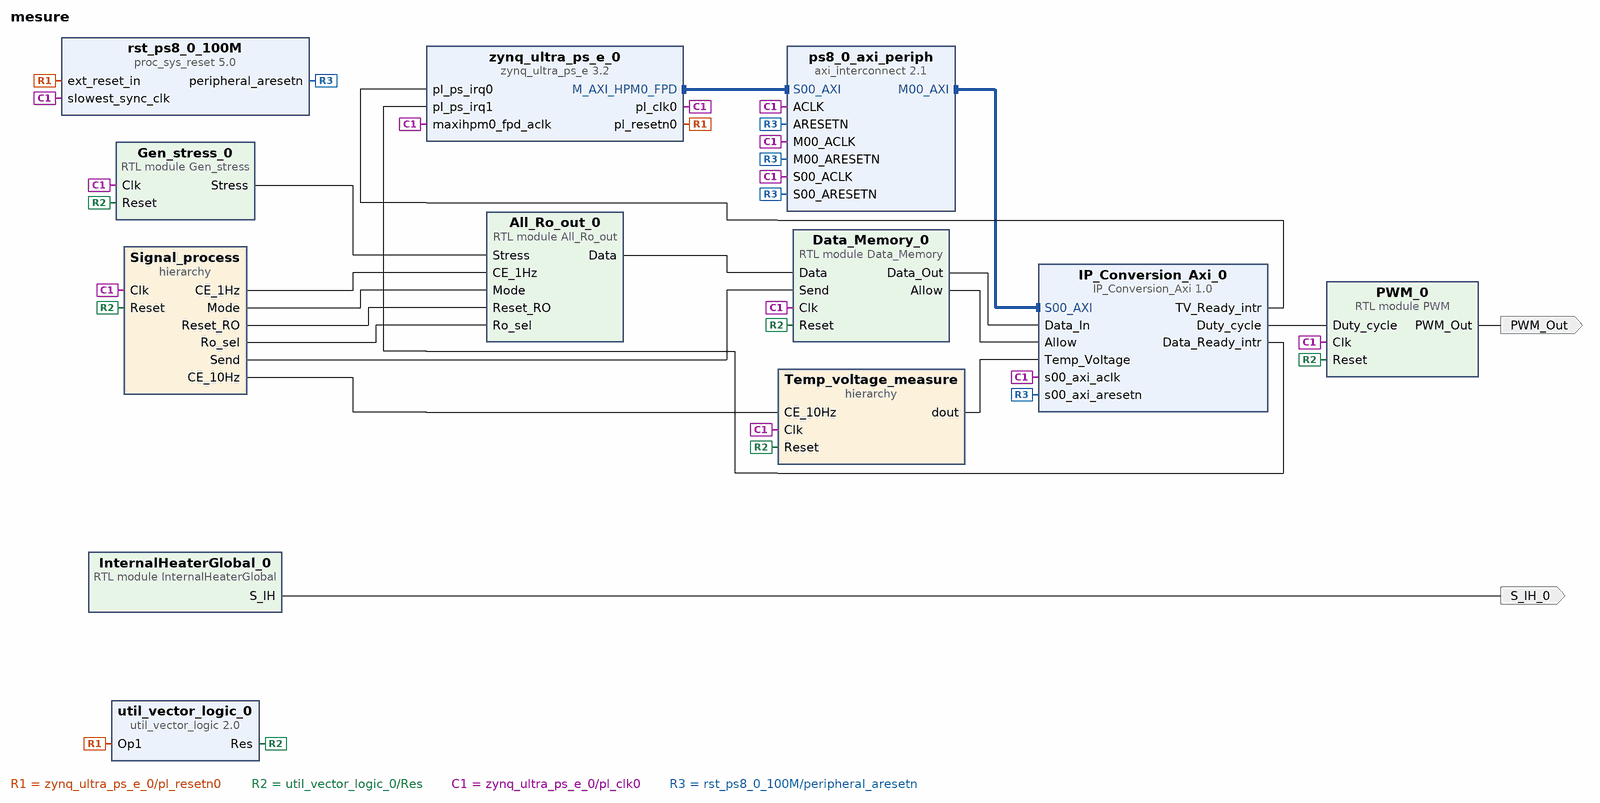
[diagram p0: block diagram of the top level]
# Vivado block design mesure, xczu3eg-sbva484-1-i, Vivado 2018.3
create_bd_design mesure

create_bd_port -dir O PWM_Out
create_bd_port -dir O S_IH_0

create_bd_cell -type ip -vlnv xilinx.com:ip:zynq_ultra_ps_e:3.2 zynq_ultra_ps_e_0
set_property -dict [list \
  CONFIG.PSU_BANK_0_IO_STANDARD LVCMOS18 \
  CONFIG.PSU_BANK_1_IO_STANDARD LVCMOS18 \
  CONFIG.PSU_BANK_2_IO_STANDARD LVCMOS18 \
  CONFIG.PSU_BANK_3_IO_STANDARD LVCMOS18 \
  CONFIG.PSU__CAN1__PERIPHERAL__ENABLE 0 \
  CONFIG.PSU__CRF_APB__ACPU_CTRL__SRCSEL APLL \
  CONFIG.PSU__CRF_APB__APLL_CTRL__SRCSEL PSS_REF_CLK \
  CONFIG.PSU__CRF_APB__DBG_FPD_CTRL__SRCSEL IOPLL \
  CONFIG.PSU__CRF_APB__DBG_TRACE_CTRL__SRCSEL IOPLL \
  CONFIG.PSU__CRF_APB__DBG_TSTMP_CTRL__SRCSEL IOPLL \
  CONFIG.PSU__CRF_APB__DDR_CTRL__FREQMHZ 533 \
  CONFIG.PSU__CRF_APB__DDR_CTRL__SRCSEL DPLL \
  CONFIG.PSU__CRF_APB__DPDMA_REF_CTRL__SRCSEL APLL \
  CONFIG.PSU__CRF_APB__DPLL_CTRL__SRCSEL PSS_REF_CLK \
  CONFIG.PSU__CRF_APB__DP_AUDIO_REF_CTRL__SRCSEL RPLL \
  CONFIG.PSU__CRF_APB__DP_STC_REF_CTRL__SRCSEL RPLL \
  CONFIG.PSU__CRF_APB__DP_VIDEO_REF_CTRL__SRCSEL VPLL \
  CONFIG.PSU__CRF_APB__GDMA_REF_CTRL__SRCSEL APLL \
  CONFIG.PSU__CRF_APB__GPU_REF_CTRL__SRCSEL IOPLL \
  CONFIG.PSU__CRF_APB__TOPSW_LSBUS_CTRL__SRCSEL IOPLL \
  CONFIG.PSU__CRF_APB__TOPSW_MAIN_CTRL__SRCSEL DPLL \
  CONFIG.PSU__CRF_APB__VPLL_CTRL__SRCSEL PSS_REF_CLK \
  CONFIG.PSU__CRF_APB__VPLL_FRAC_CFG__ENABLED 1 \
  CONFIG.PSU__CRL_APB__ADMA_REF_CTRL__SRCSEL IOPLL \
  CONFIG.PSU__CRL_APB__CAN1_REF_CTRL__SRCSEL IOPLL \
  CONFIG.PSU__CRL_APB__CPU_R5_CTRL__SRCSEL IOPLL \
  CONFIG.PSU__CRL_APB__CSU_PLL_CTRL__FREQMHZ 400 \
  CONFIG.PSU__CRL_APB__CSU_PLL_CTRL__SRCSEL IOPLL \
  CONFIG.PSU__CRL_APB__DBG_LPD_CTRL__SRCSEL IOPLL \
  CONFIG.PSU__CRL_APB__GEM3_REF_CTRL__SRCSEL IOPLL \
  CONFIG.PSU__CRL_APB__I2C0_REF_CTRL__SRCSEL IOPLL \
  CONFIG.PSU__CRL_APB__I2C1_REF_CTRL__SRCSEL IOPLL \
  CONFIG.PSU__CRL_APB__IOPLL_CTRL__DIV2 0 \
  CONFIG.PSU__CRL_APB__IOPLL_CTRL__SRCSEL PSS_REF_CLK \
  CONFIG.PSU__CRL_APB__IOU_SWITCH_CTRL__SRCSEL IOPLL \
  CONFIG.PSU__CRL_APB__LPD_LSBUS_CTRL__SRCSEL IOPLL \
  CONFIG.PSU__CRL_APB__LPD_SWITCH_CTRL__SRCSEL IOPLL \
  CONFIG.PSU__CRL_APB__PCAP_CTRL__SRCSEL IOPLL \
  CONFIG.PSU__CRL_APB__PL0_REF_CTRL__SRCSEL IOPLL \
  CONFIG.PSU__CRL_APB__QSPI_REF_CTRL__SRCSEL IOPLL \
  CONFIG.PSU__CRL_APB__RPLL_CTRL__SRCSEL PSS_REF_CLK \
  CONFIG.PSU__CRL_APB__RPLL_FRAC_CFG__ENABLED 1 \
  CONFIG.PSU__CRL_APB__SDIO0_REF_CTRL__SRCSEL IOPLL \
  CONFIG.PSU__CRL_APB__SDIO1_REF_CTRL__SRCSEL IOPLL \
  CONFIG.PSU__CRL_APB__SPI0_REF_CTRL__SRCSEL IOPLL \
  CONFIG.PSU__CRL_APB__SPI1_REF_CTRL__SRCSEL IOPLL \
  CONFIG.PSU__CRL_APB__TIMESTAMP_REF_CTRL__SRCSEL IOPLL \
  CONFIG.PSU__CRL_APB__UART0_REF_CTRL__SRCSEL IOPLL \
  CONFIG.PSU__CRL_APB__UART1_REF_CTRL__SRCSEL IOPLL \
  CONFIG.PSU__CRL_APB__USB0_BUS_REF_CTRL__FREQMHZ 250 \
  CONFIG.PSU__CRL_APB__USB0_BUS_REF_CTRL__SRCSEL IOPLL \
  CONFIG.PSU__CRL_APB__USB3_DUAL_REF_CTRL__FREQMHZ 20 \
  CONFIG.PSU__CRL_APB__USB3_DUAL_REF_CTRL__SRCSEL IOPLL \
  CONFIG.PSU__CRL_APB__USB3__ENABLE 1 \
  CONFIG.PSU__CSUPMU__PERIPHERAL__VALID 1 \
  CONFIG.PSU__DDRC__BUS_WIDTH {32 Bit} \
  CONFIG.PSU__DDRC__DEVICE_CAPACITY {16384 MBits} \
  CONFIG.PSU__DDRC__DRAM_WIDTH {32 Bits} \
  CONFIG.PSU__DDRC__ECC Disabled \
  CONFIG.PSU__DDRC__MEMORY_TYPE {LPDDR 4} \
  CONFIG.PSU__DDRC__SPEED_BIN LPDDR4_1066 \
  CONFIG.PSU__DDR_HIGH_ADDRESS_GUI_ENABLE 0 \
  CONFIG.PSU__DDR__INTERFACE__FREQMHZ 266.500 \
  CONFIG.PSU__DISPLAYPORT__LANE0__ENABLE 1 \
  CONFIG.PSU__DISPLAYPORT__LANE0__IO {GT Lane1} \
  CONFIG.PSU__DISPLAYPORT__LANE1__ENABLE 1 \
  CONFIG.PSU__DISPLAYPORT__LANE1__IO {GT Lane0} \
  CONFIG.PSU__DISPLAYPORT__PERIPHERAL__ENABLE 1 \
  CONFIG.PSU__DLL__ISUSED 1 \
  CONFIG.PSU__DPAUX__PERIPHERAL__ENABLE 1 \
  CONFIG.PSU__DPAUX__PERIPHERAL__IO {MIO 27 .. 30} \
  CONFIG.PSU__DP__LANE_SEL {Dual Lower} \
  CONFIG.PSU__DP__REF_CLK_FREQ 27 \
  CONFIG.PSU__DP__REF_CLK_SEL {Ref Clk1} \
  CONFIG.PSU__ENET3__PERIPHERAL__ENABLE 0 \
  CONFIG.PSU__FPGA_PL0_ENABLE 1 \
  CONFIG.PSU__GPIO0_MIO__IO {MIO 0 .. 25} \
  CONFIG.PSU__GPIO0_MIO__PERIPHERAL__ENABLE 1 \
  CONFIG.PSU__GPIO1_MIO__IO {MIO 26 .. 51} \
  CONFIG.PSU__GPIO1_MIO__PERIPHERAL__ENABLE 1 \
  CONFIG.PSU__GPIO2_MIO__IO {MIO 52 .. 77} \
  CONFIG.PSU__GPIO2_MIO__PERIPHERAL__ENABLE 1 \
  CONFIG.PSU__GT__LINK_SPEED HBR \
  CONFIG.PSU__GT__PRE_EMPH_LVL_4 0 \
  CONFIG.PSU__GT__VLT_SWNG_LVL_4 0 \
  CONFIG.PSU__I2C0__PERIPHERAL__ENABLE 0 \
  CONFIG.PSU__I2C1__PERIPHERAL__ENABLE 1 \
  CONFIG.PSU__I2C1__PERIPHERAL__IO {MIO 4 .. 5} \
  CONFIG.PSU__IOU_SLCR__IOU_TTC_APB_CLK__TTC0_SEL APB \
  CONFIG.PSU__IOU_SLCR__IOU_TTC_APB_CLK__TTC1_SEL APB \
  CONFIG.PSU__IOU_SLCR__IOU_TTC_APB_CLK__TTC2_SEL APB \
  CONFIG.PSU__IOU_SLCR__IOU_TTC_APB_CLK__TTC3_SEL APB \
  CONFIG.PSU__MAXIGP0__DATA_WIDTH 128 \
  CONFIG.PSU__OVERRIDE__BASIC_CLOCK 1 \
  CONFIG.PSU__PMU_COHERENCY 0 \
  CONFIG.PSU__PMU__AIBACK__ENABLE 0 \
  CONFIG.PSU__PMU__EMIO_GPI__ENABLE 0 \
  CONFIG.PSU__PMU__EMIO_GPO__ENABLE 0 \
  CONFIG.PSU__PMU__GPI0__ENABLE 1 \
  CONFIG.PSU__PMU__GPI0__IO {MIO 26} \
  CONFIG.PSU__PMU__GPI1__ENABLE 0 \
  CONFIG.PSU__PMU__GPI2__ENABLE 0 \
  CONFIG.PSU__PMU__GPI3__ENABLE 0 \
  CONFIG.PSU__PMU__GPI4__ENABLE 0 \
  CONFIG.PSU__PMU__GPI5__ENABLE 0 \
  CONFIG.PSU__PMU__GPO0__ENABLE 1 \
  CONFIG.PSU__PMU__GPO0__IO {MIO 32} \
  CONFIG.PSU__PMU__GPO1__ENABLE 1 \
  CONFIG.PSU__PMU__GPO1__IO {MIO 33} \
  CONFIG.PSU__PMU__GPO2__ENABLE 1 \
  CONFIG.PSU__PMU__GPO2__IO {MIO 34} \
  CONFIG.PSU__PMU__GPO2__POLARITY high \
  CONFIG.PSU__PMU__GPO3__ENABLE 0 \
  CONFIG.PSU__PMU__GPO4__ENABLE 0 \
  CONFIG.PSU__PMU__GPO5__ENABLE 0 \
  CONFIG.PSU__PMU__PERIPHERAL__ENABLE 1 \
  CONFIG.PSU__PMU__PLERROR__ENABLE 0 \
  CONFIG.PSU__PRESET_APPLIED 1 \
  CONFIG.PSU__PSS_REF_CLK__FREQMHZ 33.333333 \
  CONFIG.PSU__QSPI__PERIPHERAL__ENABLE 0 \
  CONFIG.PSU__SATA__PERIPHERAL__ENABLE 0 \
  CONFIG.PSU__SD0__DATA_TRANSFER_MODE 4Bit \
  CONFIG.PSU__SD0__GRP_CD__ENABLE 1 \
  CONFIG.PSU__SD0__GRP_CD__IO {MIO 24} \
  CONFIG.PSU__SD0__PERIPHERAL__ENABLE 1 \
  CONFIG.PSU__SD0__PERIPHERAL__IO {MIO 13 .. 16 21 22} \
  CONFIG.PSU__SD0__SLOT_TYPE {SD 2.0} \
  CONFIG.PSU__SD1_COHERENCY 0 \
  CONFIG.PSU__SD1__DATA_TRANSFER_MODE 4Bit \
  CONFIG.PSU__SD1__GRP_CD__ENABLE 0 \
  CONFIG.PSU__SD1__GRP_POW__ENABLE 0 \
  CONFIG.PSU__SD1__GRP_WP__ENABLE 0 \
  CONFIG.PSU__SD1__PERIPHERAL__ENABLE 1 \
  CONFIG.PSU__SD1__PERIPHERAL__IO {MIO 46 .. 51} \
  CONFIG.PSU__SD1__SLOT_TYPE {SD 2.0} \
  CONFIG.PSU__SPI0__GRP_SS0__IO {MIO 41} \
  CONFIG.PSU__SPI0__PERIPHERAL__ENABLE 1 \
  CONFIG.PSU__SPI0__PERIPHERAL__IO {MIO 38 .. 43} \
  CONFIG.PSU__SPI1__GRP_SS0__IO {MIO 9} \
  CONFIG.PSU__SPI1__PERIPHERAL__ENABLE 1 \
  CONFIG.PSU__SPI1__PERIPHERAL__IO {MIO 6 .. 11} \
  CONFIG.PSU__SWDT0__CLOCK__ENABLE 0 \
  CONFIG.PSU__SWDT0__PERIPHERAL__ENABLE 1 \
  CONFIG.PSU__SWDT0__RESET__ENABLE 0 \
  CONFIG.PSU__SWDT1__CLOCK__ENABLE 0 \
  CONFIG.PSU__SWDT1__PERIPHERAL__ENABLE 1 \
  CONFIG.PSU__SWDT1__RESET__ENABLE 0 \
  CONFIG.PSU__TTC0__CLOCK__ENABLE 0 \
  CONFIG.PSU__TTC0__PERIPHERAL__ENABLE 1 \
  CONFIG.PSU__TTC0__WAVEOUT__ENABLE 0 \
  CONFIG.PSU__TTC1__CLOCK__ENABLE 0 \
  CONFIG.PSU__TTC1__PERIPHERAL__ENABLE 1 \
  CONFIG.PSU__TTC1__WAVEOUT__ENABLE 0 \
  CONFIG.PSU__TTC2__CLOCK__ENABLE 0 \
  CONFIG.PSU__TTC2__PERIPHERAL__ENABLE 1 \
  CONFIG.PSU__TTC2__WAVEOUT__ENABLE 0 \
  CONFIG.PSU__TTC3__CLOCK__ENABLE 0 \
  CONFIG.PSU__TTC3__PERIPHERAL__ENABLE 1 \
  CONFIG.PSU__TTC3__WAVEOUT__ENABLE 0 \
  CONFIG.PSU__UART0__BAUD_RATE 115200 \
  CONFIG.PSU__UART0__MODEM__ENABLE 0 \
  CONFIG.PSU__UART0__PERIPHERAL__ENABLE 1 \
  CONFIG.PSU__UART0__PERIPHERAL__IO {MIO 2 .. 3} \
  CONFIG.PSU__UART1__BAUD_RATE 115200 \
  CONFIG.PSU__UART1__MODEM__ENABLE 0 \
  CONFIG.PSU__UART1__PERIPHERAL__ENABLE 1 \
  CONFIG.PSU__UART1__PERIPHERAL__IO {MIO 0 .. 1} \
  CONFIG.PSU__USB0_COHERENCY 0 \
  CONFIG.PSU__USB0__PERIPHERAL__ENABLE 1 \
  CONFIG.PSU__USB0__PERIPHERAL__IO {MIO 52 .. 63} \
  CONFIG.PSU__USB0__REF_CLK_FREQ 26 \
  CONFIG.PSU__USB0__REF_CLK_SEL {Ref Clk0} \
  CONFIG.PSU__USB1__PERIPHERAL__ENABLE 1 \
  CONFIG.PSU__USB1__PERIPHERAL__IO {MIO 64 .. 75} \
  CONFIG.PSU__USB1__REF_CLK_FREQ 26 \
  CONFIG.PSU__USB1__REF_CLK_SEL {Ref Clk0} \
  CONFIG.PSU__USB2_0__EMIO__ENABLE 0 \
  CONFIG.PSU__USB3_0__EMIO__ENABLE 0 \
  CONFIG.PSU__USB3_0__PERIPHERAL__ENABLE 1 \
  CONFIG.PSU__USB3_0__PERIPHERAL__IO {GT Lane2} \
  CONFIG.PSU__USB3_1__PERIPHERAL__ENABLE 1 \
  CONFIG.PSU__USB3_1__PERIPHERAL__IO {GT Lane3} \
  CONFIG.PSU__USB__RESET__MODE {Boot Pin} \
  CONFIG.PSU__USB__RESET__POLARITY {Active Low} \
  CONFIG.PSU__USE__IRQ0 1 \
  CONFIG.PSU__USE__IRQ1 1 \
  CONFIG.PSU__USE__M_AXI_GP0 1 \
  CONFIG.PSU__USE__M_AXI_GP1 0 \
  CONFIG.PSU__USE__M_AXI_GP2 0 \
  CONFIG.SUBPRESET1 Custom \
] [get_bd_cells zynq_ultra_ps_e_0]
# 234 more settings of zynq_ultra_ps_e_0 are not shown: defaults, MIO pin electricals, DDR timing, and values the tool derives
create_bd_cell -type ip -vlnv xilinx.com:ip:util_vector_logic:2.0 util_vector_logic_0
set_property -dict {CONFIG.C_OPERATION not CONFIG.C_SIZE 1} [get_bd_cells util_vector_logic_0]
create_bd_cell -type ip -vlnv xilinx.com:ip:axi_interconnect:2.1 ps8_0_axi_periph
set_property -dict {CONFIG.NUM_MI 1} [get_bd_cells ps8_0_axi_periph]
create_bd_cell -type ip -vlnv xilinx.com:ip:proc_sys_reset:5.0 rst_ps8_0_100M
create_bd_cell -type module -reference Gen_stress Gen_stress_0
create_bd_cell -type module -reference All_Ro_out All_Ro_out_0
create_bd_cell -type hier Signal_process
create_bd_cell -type hier Temp_voltage_measure
create_bd_cell -type module -reference Data_Memory Data_Memory_0
create_bd_cell -type ip -vlnv IMS.bordeaux:user:IP_Conversion_Axi:1.0 IP_Conversion_Axi_0
create_bd_cell -type module -reference PWM PWM_0
create_bd_cell -type module -reference InternalHeaterGlobal InternalHeaterGlobal_0
set_property -dict {CONFIG.N_HEATERS 50} [get_bd_cells InternalHeaterGlobal_0]

# ---- hierarchy /Signal_process ----
current_bd_instance /Signal_process
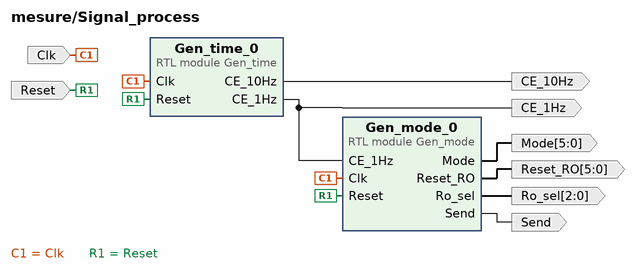
[diagram p1: block diagram inside /Signal_process]
create_bd_pin -dir I -type clk Clk
create_bd_pin -dir I -type rst Reset
create_bd_pin -dir O CE_1Hz
create_bd_pin -dir O -from 5 -to 0 Mode
create_bd_pin -dir O -from 5 -to 0 Reset_RO
create_bd_pin -dir O -from 2 -to 0 Ro_sel
create_bd_pin -dir O Send
create_bd_pin -dir O CE_10Hz

create_bd_cell -type module -reference Gen_time Gen_time_0
create_bd_cell -type module -reference Gen_mode Gen_mode_0

# ---- hierarchy /Temp_voltage_measure ----
current_bd_instance /Temp_voltage_measure
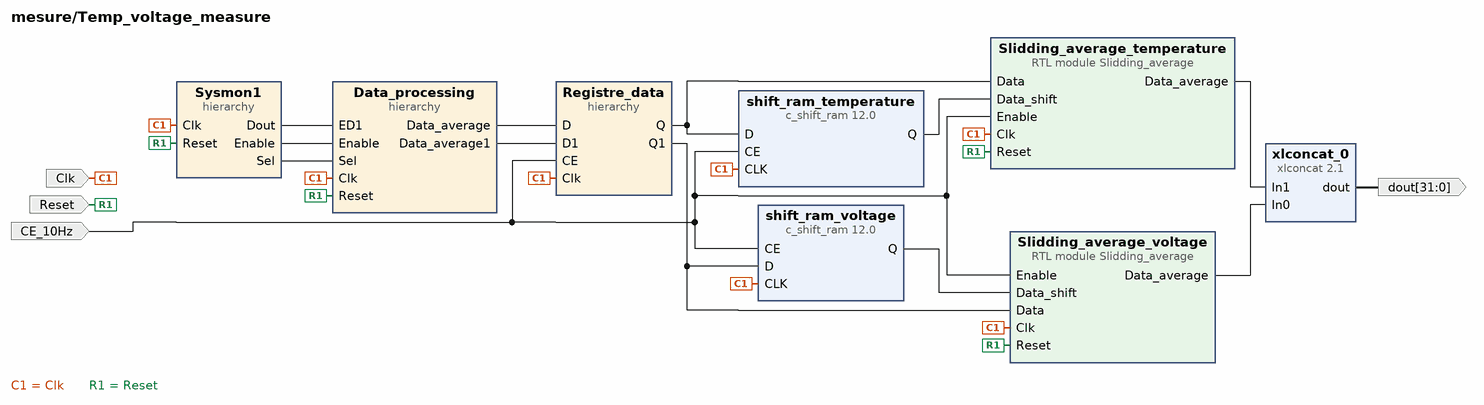
[diagram p2: block diagram inside /Temp_voltage_measure]
create_bd_pin -dir I Clk
create_bd_pin -dir I CE_10Hz
create_bd_pin -dir I Reset
create_bd_pin -dir O -from 31 -to 0 dout

create_bd_cell -type ip -vlnv xilinx.com:ip:c_shift_ram:12.0 shift_ram_voltage
set_property -dict {CONFIG.CE true} [get_bd_cells shift_ram_voltage]
create_bd_cell -type ip -vlnv xilinx.com:ip:c_shift_ram:12.0 shift_ram_temperature
set_property -dict {CONFIG.CE true} [get_bd_cells shift_ram_temperature]
create_bd_cell -type module -reference Slidding_average Slidding_average_voltage
create_bd_cell -type module -reference Slidding_average Slidding_average_temperature
create_bd_cell -type ip -vlnv xilinx.com:ip:xlconcat:2.1 xlconcat_0
set_property -dict {CONFIG.IN0_WIDTH 16 CONFIG.IN1_WIDTH 16} [get_bd_cells xlconcat_0]
create_bd_cell -type hier Sysmon1
create_bd_cell -type hier Registre_data
create_bd_cell -type hier Data_processing

# ---- hierarchy /Temp_voltage_measure/Sysmon1 ----
current_bd_instance /Temp_voltage_measure/Sysmon1
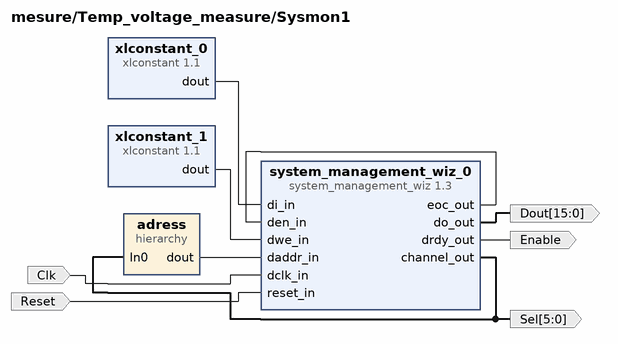
[diagram p3: block diagram inside /Temp_voltage_measure/Sysmon1]
create_bd_pin -dir O -from 15 -to 0 Dout
create_bd_pin -dir O Enable
create_bd_pin -dir I Clk
create_bd_pin -dir O -from 5 -to 0 Sel
create_bd_pin -dir I Reset

create_bd_cell -type ip -vlnv xilinx.com:ip:xlconstant:1.1 xlconstant_0
set_property -dict {CONFIG.CONST_VAL 0 CONFIG.CONST_WIDTH 16} [get_bd_cells xlconstant_0]
create_bd_cell -type ip -vlnv xilinx.com:ip:system_management_wiz:1.3 system_management_wiz_0
set_property -dict {CONFIG.ENABLE_RESET true CONFIG.INTERFACE_SELECTION Enable_DRP} [get_bd_cells system_management_wiz_0]
create_bd_cell -type ip -vlnv xilinx.com:ip:xlconstant:1.1 xlconstant_1
set_property -dict {CONFIG.CONST_VAL 0 CONFIG.CONST_WIDTH 1} [get_bd_cells xlconstant_1]
create_bd_cell -type hier adress

# ---- hierarchy /Temp_voltage_measure/Sysmon1/adress ----
current_bd_instance /Temp_voltage_measure/Sysmon1/adress
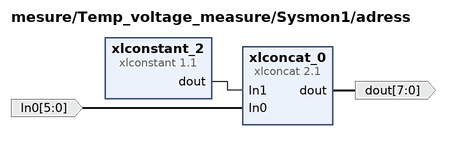
[diagram p4: block diagram inside /Temp_voltage_measure/Sysmon1/adress]
create_bd_pin -dir I -from 5 -to 0 In0
create_bd_pin -dir O -from 7 -to 0 dout

create_bd_cell -type ip -vlnv xilinx.com:ip:xlconcat:2.1 xlconcat_0
set_property -dict {CONFIG.IN0_WIDTH 6 CONFIG.IN1_WIDTH 2} [get_bd_cells xlconcat_0]
create_bd_cell -type ip -vlnv xilinx.com:ip:xlconstant:1.1 xlconstant_2
set_property -dict {CONFIG.CONST_VAL 0 CONFIG.CONST_WIDTH 2} [get_bd_cells xlconstant_2]

# ---- hierarchy /Temp_voltage_measure/Registre_data ----
current_bd_instance /Temp_voltage_measure/Registre_data
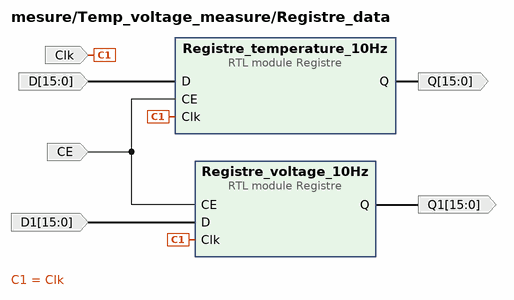
[diagram p5: block diagram inside /Temp_voltage_measure/Registre_data]
create_bd_pin -dir I -type clk Clk
create_bd_pin -dir I CE
create_bd_pin -dir I -from 15 -to 0 D
create_bd_pin -dir I -from 15 -to 0 D1
create_bd_pin -dir O -from 15 -to 0 Q
create_bd_pin -dir O -from 15 -to 0 Q1

create_bd_cell -type module -reference Registre Registre_temperature_10Hz
create_bd_cell -type module -reference Registre Registre_voltage_10Hz

# ---- hierarchy /Temp_voltage_measure/Data_processing ----
current_bd_instance /Temp_voltage_measure/Data_processing
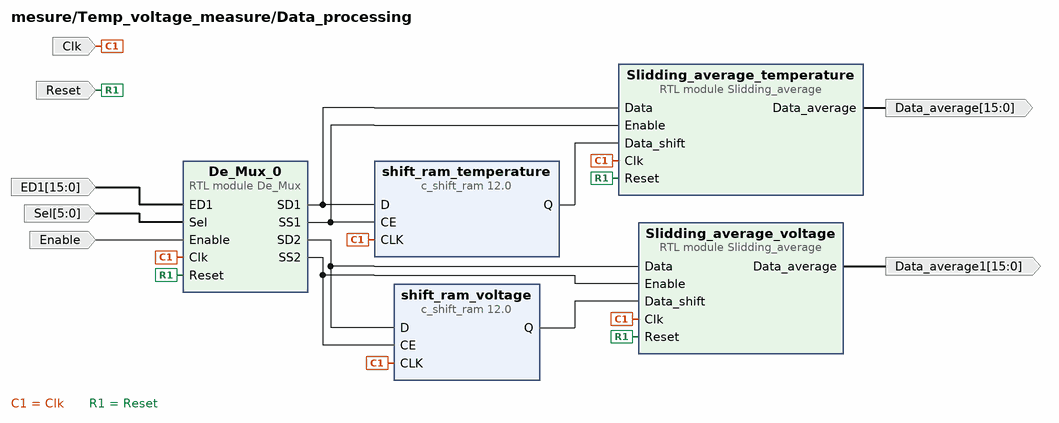
[diagram p6: block diagram inside /Temp_voltage_measure/Data_processing]
create_bd_pin -dir O -from 15 -to 0 Data_average
create_bd_pin -dir O -from 15 -to 0 Data_average1
create_bd_pin -dir I -type clk Clk
create_bd_pin -dir I -type rst Reset
create_bd_pin -dir I -from 15 -to 0 ED1
create_bd_pin -dir I -from 5 -to 0 Sel
create_bd_pin -dir I Enable

create_bd_cell -type ip -vlnv xilinx.com:ip:c_shift_ram:12.0 shift_ram_voltage
set_property -dict {CONFIG.CE true} [get_bd_cells shift_ram_voltage]
create_bd_cell -type module -reference Slidding_average Slidding_average_voltage
create_bd_cell -type ip -vlnv xilinx.com:ip:c_shift_ram:12.0 shift_ram_temperature
set_property -dict {CONFIG.CE true} [get_bd_cells shift_ram_temperature]
create_bd_cell -type module -reference Slidding_average Slidding_average_temperature
create_bd_cell -type module -reference De_Mux De_Mux_0

# ---- connections ----

current_bd_instance /Signal_process
connect_bd_net [get_bd_pins Clk] [get_bd_pins Gen_mode_0/Clk] [get_bd_pins Gen_time_0/Clk]
connect_bd_net [get_bd_pins Reset] [get_bd_pins Gen_mode_0/Reset] [get_bd_pins Gen_time_0/Reset]
connect_bd_net [get_bd_pins Gen_time_0/CE_1Hz] [get_bd_pins CE_1Hz] [get_bd_pins Gen_mode_0/CE_1Hz]
connect_bd_net [get_bd_pins Gen_mode_0/Mode] [get_bd_pins Mode]
connect_bd_net [get_bd_pins Gen_mode_0/Reset_RO] [get_bd_pins Reset_RO]
connect_bd_net [get_bd_pins Gen_mode_0/Ro_sel] [get_bd_pins Ro_sel]
connect_bd_net [get_bd_pins Gen_mode_0/Send] [get_bd_pins Send]
connect_bd_net [get_bd_pins Gen_time_0/CE_10Hz] [get_bd_pins CE_10Hz]

current_bd_instance /Temp_voltage_measure
connect_bd_net [get_bd_pins Registre_data/Q1] [get_bd_pins shift_ram_voltage/D] [get_bd_pins Slidding_average_voltage/Data]
connect_bd_net [get_bd_pins shift_ram_voltage/Q] [get_bd_pins Slidding_average_voltage/Data_shift]
connect_bd_net [get_bd_pins Registre_data/Q] [get_bd_pins shift_ram_temperature/D] [get_bd_pins Slidding_average_temperature/Data]
connect_bd_net [get_bd_pins shift_ram_temperature/Q] [get_bd_pins Slidding_average_temperature/Data_shift]
connect_bd_net [get_bd_pins Sysmon1/Dout] [get_bd_pins Data_processing/ED1]
connect_bd_net [get_bd_pins Sysmon1/Enable] [get_bd_pins Data_processing/Enable]
connect_bd_net [get_bd_pins Sysmon1/Sel] [get_bd_pins Data_processing/Sel]
connect_bd_net [get_bd_pins Data_processing/Data_average] [get_bd_pins Registre_data/D]
connect_bd_net [get_bd_pins Data_processing/Data_average1] [get_bd_pins Registre_data/D1]
connect_bd_net [get_bd_pins Clk] \
  [get_bd_pins Sysmon1/Clk] [get_bd_pins Registre_data/Clk] [get_bd_pins Data_processing/Clk] \
  [get_bd_pins Slidding_average_temperature/Clk] [get_bd_pins shift_ram_temperature/CLK] [get_bd_pins shift_ram_voltage/CLK] \
  [get_bd_pins Slidding_average_voltage/Clk]
connect_bd_net -net CE_1 [get_bd_pins CE_10Hz] \
  [get_bd_pins Registre_data/CE] [get_bd_pins Slidding_average_temperature/Enable] \
  [get_bd_pins Slidding_average_voltage/Enable] [get_bd_pins shift_ram_voltage/CE] [get_bd_pins shift_ram_temperature/CE]
connect_bd_net [get_bd_pins Reset] \
  [get_bd_pins Sysmon1/Reset] [get_bd_pins Data_processing/Reset] [get_bd_pins Slidding_average_temperature/Reset] \
  [get_bd_pins Slidding_average_voltage/Reset]
connect_bd_net [get_bd_pins xlconcat_0/dout] [get_bd_pins dout]
connect_bd_net [get_bd_pins Slidding_average_temperature/Data_average] [get_bd_pins xlconcat_0/In1]
connect_bd_net [get_bd_pins Slidding_average_voltage/Data_average] [get_bd_pins xlconcat_0/In0]

current_bd_instance /Temp_voltage_measure/Sysmon1
connect_bd_net [get_bd_pins xlconstant_0/dout] [get_bd_pins system_management_wiz_0/di_in]
connect_bd_net [get_bd_pins adress/dout] [get_bd_pins system_management_wiz_0/daddr_in]
connect_bd_net [get_bd_pins system_management_wiz_0/eoc_out] [get_bd_pins system_management_wiz_0/den_in]
connect_bd_net [get_bd_pins xlconstant_1/dout] [get_bd_pins system_management_wiz_0/dwe_in]
connect_bd_net [get_bd_pins system_management_wiz_0/do_out] [get_bd_pins Dout]
connect_bd_net [get_bd_pins system_management_wiz_0/drdy_out] [get_bd_pins Enable]
connect_bd_net -net dclk_in_0_1 [get_bd_pins Clk] [get_bd_pins system_management_wiz_0/dclk_in]
connect_bd_net [get_bd_pins system_management_wiz_0/channel_out] [get_bd_pins adress/In0] [get_bd_pins Sel]
connect_bd_net [get_bd_pins Reset] [get_bd_pins system_management_wiz_0/reset_in]

current_bd_instance /Temp_voltage_measure/Sysmon1/adress
connect_bd_net [get_bd_pins xlconstant_2/dout] [get_bd_pins xlconcat_0/In1]
connect_bd_net -net system_management_wiz_0_channel_out [get_bd_pins In0] [get_bd_pins xlconcat_0/In0]
connect_bd_net [get_bd_pins xlconcat_0/dout] [get_bd_pins dout]

current_bd_instance /Temp_voltage_measure/Registre_data
connect_bd_net [get_bd_pins Clk] [get_bd_pins Registre_temperature_10Hz/Clk] [get_bd_pins Registre_voltage_10Hz/Clk]
connect_bd_net [get_bd_pins CE] [get_bd_pins Registre_temperature_10Hz/CE] [get_bd_pins Registre_voltage_10Hz/CE]
connect_bd_net [get_bd_pins D] [get_bd_pins Registre_temperature_10Hz/D]
connect_bd_net -net D1_1 [get_bd_pins D1] [get_bd_pins Registre_voltage_10Hz/D]
connect_bd_net [get_bd_pins Registre_temperature_10Hz/Q] [get_bd_pins Q]
connect_bd_net [get_bd_pins Registre_voltage_10Hz/Q] [get_bd_pins Q1]

current_bd_instance /Temp_voltage_measure/Data_processing
connect_bd_net [get_bd_pins De_Mux_0/SD2] [get_bd_pins shift_ram_voltage/D] [get_bd_pins Slidding_average_voltage/Data]
connect_bd_net [get_bd_pins De_Mux_0/SS2] [get_bd_pins shift_ram_voltage/CE] [get_bd_pins Slidding_average_voltage/Enable]
connect_bd_net [get_bd_pins shift_ram_voltage/Q] [get_bd_pins Slidding_average_voltage/Data_shift]
connect_bd_net [get_bd_pins De_Mux_0/SD1] [get_bd_pins shift_ram_temperature/D] [get_bd_pins Slidding_average_temperature/Data]
connect_bd_net [get_bd_pins De_Mux_0/SS1] [get_bd_pins shift_ram_temperature/CE] [get_bd_pins Slidding_average_temperature/Enable]
connect_bd_net [get_bd_pins shift_ram_temperature/Q] [get_bd_pins Slidding_average_temperature/Data_shift]
connect_bd_net [get_bd_pins Slidding_average_temperature/Data_average] [get_bd_pins Data_average]
connect_bd_net [get_bd_pins Slidding_average_voltage/Data_average] [get_bd_pins Data_average1]
connect_bd_net [get_bd_pins Clk] \
  [get_bd_pins De_Mux_0/Clk] [get_bd_pins shift_ram_temperature/CLK] [get_bd_pins shift_ram_voltage/CLK] \
  [get_bd_pins Slidding_average_temperature/Clk] [get_bd_pins Slidding_average_voltage/Clk]
connect_bd_net [get_bd_pins Reset] \
  [get_bd_pins De_Mux_0/Reset] [get_bd_pins Slidding_average_temperature/Reset] [get_bd_pins Slidding_average_voltage/Reset]
connect_bd_net -net ED1_1 [get_bd_pins ED1] [get_bd_pins De_Mux_0/ED1]
connect_bd_net [get_bd_pins Sel] [get_bd_pins De_Mux_0/Sel]
connect_bd_net [get_bd_pins Enable] [get_bd_pins De_Mux_0/Enable]

current_bd_instance /
connect_bd_intf_net [get_bd_intf_pins ps8_0_axi_periph/M00_AXI] [get_bd_intf_pins IP_Conversion_Axi_0/S00_AXI]
connect_bd_intf_net [get_bd_intf_pins zynq_ultra_ps_e_0/M_AXI_HPM0_FPD] [get_bd_intf_pins ps8_0_axi_periph/S00_AXI]
connect_bd_net [get_bd_pins Gen_stress_0/Stress] [get_bd_pins All_Ro_out_0/Stress]
connect_bd_net [get_bd_pins zynq_ultra_ps_e_0/pl_resetn0] [get_bd_pins util_vector_logic_0/Op1] [get_bd_pins rst_ps8_0_100M/ext_reset_in]
connect_bd_net [get_bd_pins util_vector_logic_0/Res] \
  [get_bd_pins Gen_stress_0/Reset] [get_bd_pins Temp_voltage_measure/Reset] [get_bd_pins Signal_process/Reset] \
  [get_bd_pins Data_Memory_0/Reset] [get_bd_pins PWM_0/Reset]
connect_bd_net [get_bd_pins zynq_ultra_ps_e_0/pl_clk0] \
  [get_bd_pins zynq_ultra_ps_e_0/maxihpm0_fpd_aclk] [get_bd_pins ps8_0_axi_periph/S00_ACLK] \
  [get_bd_pins rst_ps8_0_100M/slowest_sync_clk] [get_bd_pins ps8_0_axi_periph/M00_ACLK] [get_bd_pins ps8_0_axi_periph/ACLK] \
  [get_bd_pins Gen_stress_0/Clk] [get_bd_pins Temp_voltage_measure/Clk] [get_bd_pins Signal_process/Clk] \
  [get_bd_pins Data_Memory_0/Clk] [get_bd_pins IP_Conversion_Axi_0/s00_axi_aclk] [get_bd_pins PWM_0/Clk]
connect_bd_net [get_bd_pins rst_ps8_0_100M/peripheral_aresetn] \
  [get_bd_pins ps8_0_axi_periph/S00_ARESETN] [get_bd_pins ps8_0_axi_periph/M00_ARESETN] \
  [get_bd_pins ps8_0_axi_periph/ARESETN] [get_bd_pins IP_Conversion_Axi_0/s00_axi_aresetn]
connect_bd_net [get_bd_pins All_Ro_out_0/Data] [get_bd_pins Data_Memory_0/Data]
connect_bd_net [get_bd_pins Signal_process/CE_1Hz] [get_bd_pins All_Ro_out_0/CE_1Hz]
connect_bd_net [get_bd_pins Signal_process/Mode] [get_bd_pins All_Ro_out_0/Mode]
connect_bd_net [get_bd_pins Signal_process/Reset_RO] [get_bd_pins All_Ro_out_0/Reset_RO]
connect_bd_net [get_bd_pins Signal_process/Ro_sel] [get_bd_pins All_Ro_out_0/Ro_sel]
connect_bd_net [get_bd_pins Data_Memory_0/Data_Out] [get_bd_pins IP_Conversion_Axi_0/Data_In]
connect_bd_net [get_bd_pins Data_Memory_0/Allow] [get_bd_pins IP_Conversion_Axi_0/Allow]
connect_bd_net [get_bd_pins Signal_process/Send] [get_bd_pins Data_Memory_0/Send]
connect_bd_net [get_bd_pins Temp_voltage_measure/dout] [get_bd_pins IP_Conversion_Axi_0/Temp_Voltage]
connect_bd_net [get_bd_pins Signal_process/CE_10Hz] [get_bd_pins Temp_voltage_measure/CE_10Hz]
connect_bd_net -net IP_Conversion_Axi_0_TV_Ready [get_bd_pins IP_Conversion_Axi_0/TV_Ready_intr] [get_bd_pins zynq_ultra_ps_e_0/pl_ps_irq0]
connect_bd_net -net IP_Conversion_Axi_0_Data_Ready [get_bd_pins IP_Conversion_Axi_0/Data_Ready_intr] [get_bd_pins zynq_ultra_ps_e_0/pl_ps_irq1]
connect_bd_net [get_bd_pins PWM_0/PWM_Out] [get_bd_ports PWM_Out]
connect_bd_net [get_bd_pins IP_Conversion_Axi_0/Duty_cycle] [get_bd_pins PWM_0/Duty_cycle]
connect_bd_net [get_bd_pins InternalHeaterGlobal_0/S_IH] [get_bd_ports S_IH_0]

# ---- address map ----
assign_bd_address -offset 0x00A0000000 -range 4K -target_address_space [get_bd_addr_spaces zynq_ultra_ps_e_0/Data] [get_bd_addr_segs IP_Conversion_Axi_0/S00_AXI/S00_AXI_reg]

validate_bd_design
save_bd_design
